# Altium project MainV2.PrjPcb
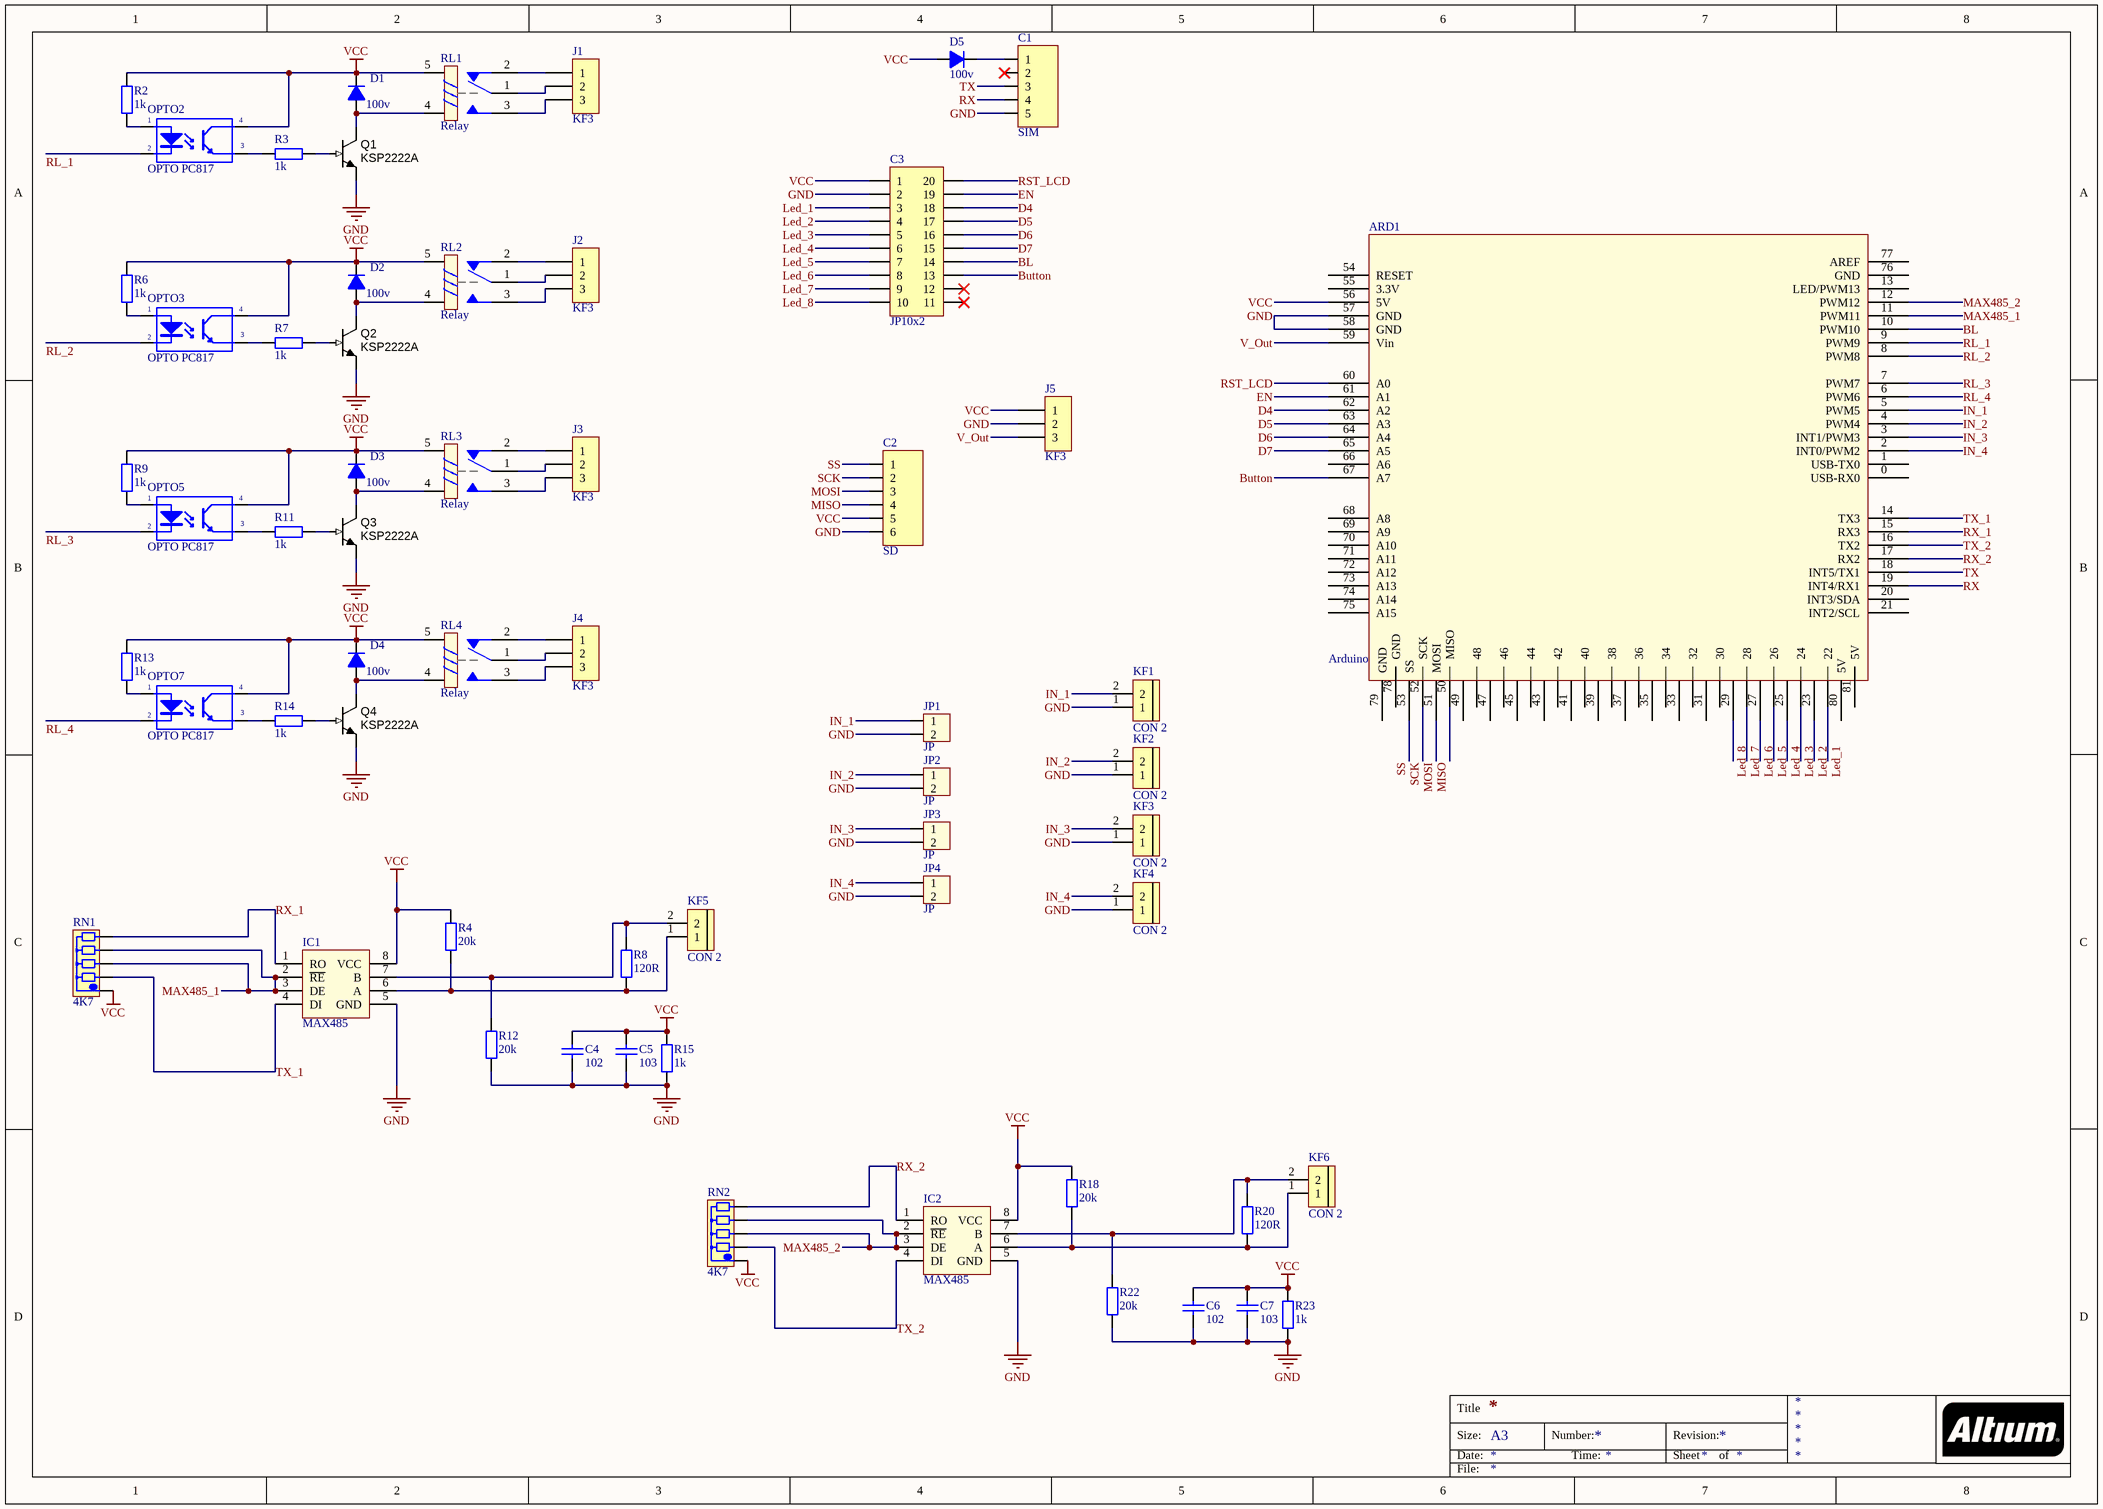
[diagram p0: Sheet4.SchDoc]
1 sheet, 60 parts. Net scope: global (net labels, ports and power ports of the same name join across sheets).
Board file: PCB4.PcbDoc

## Sheet Sheet4.SchDoc
size A3

### Parts
ARD1  Arduino  [Arduino]
C1  SIM  [JP5-C1T]
C2  SD  [JP6-C1T]
C3  JP10x2  [JP10-C2T]
C4  102  [tu gom]
C5  103  [tu gom]
C6  102  [tu gom]
C7  103  [tu gom]
D1  100v  [DIODE 1A]
D2  100v  [DIODE 1A]
D3  100v  [DIODE 1A]
D4  100v  [DIODE 1A]
D5  100v  [DIODE 1A]
IC1  MAX485  [DIP8/W0.3]
IC2  MAX485  [DIP8/W0.3]
J1  KF3  [KF3-5.08]
J2  KF3  [KF3-5.08]
J3  KF3  [KF3-5.08]
J4  KF3  [KF3-5.08]
J5  KF3  [KF3-5.08]
JP1  JP  [jam2]
JP2  JP  [jam2]
JP3  JP  [jam2]
JP4  JP  [jam2]
KF1  CON 2  [Con 2 KF301 5.08]
KF2  CON 2  [Con 2 KF301 5.08]
KF3  CON 2  [Con 2 KF301 5.08]
KF4  CON 2  [Con 2 KF301 5.08]
KF5  CON 2  [Con 2 KF301 5.08]
KF6  CON 2  [Con 2 KF301 5.08]
OPTO2  OPTO PC817  [DIP4/W0.3]
OPTO3  OPTO PC817  [DIP4/W0.3]
OPTO5  OPTO PC817  [DIP4/W0.3]
OPTO7  OPTO PC817  [DIP4/W0.3]
Q1  KSP2222A  [TO-92_Flat]
Q2  KSP2222A  [TO-92_Flat]
Q3  KSP2222A  [TO-92_Flat]
Q4  KSP2222A  [TO-92_Flat]
R2  1k  [tro vach 1/2w]
R3  1k  [tro vach 1/2w]
R4  20k  [tro vach 1/4w]
R6  1k  [tro vach 1/2w]
R7  1k  [tro vach 1/2w]
R8  120R  [tro vach 1/4w]
R9  1k  [tro vach 1/2w]
R11  1k  [tro vach 1/2w]
R12  20k  [tro vach 1/4w]
R13  1k  [tro vach 1/2w]
R14  1k  [tro vach 1/2w]
R15  1k  [tro vach 1/4w]
R18  20k  [tro vach 1/4w]
R20  120R  [tro vach 1/4w]
R22  20k  [tro vach 1/4w]
R23  1k  [tro vach 1/4w]
RL1  Relay  [Relay 5 Chan SRD]
RL2  Relay  [Relay 5 Chan SRD]
RL3  Relay  [Relay 5 Chan SRD]
RL4  Relay  [Relay 5 Chan SRD]
RN1  4K7  [RN4]
RN2  4K7  [RN4]

### Nets
GND: ARD1.57(GND) ARD1.58(GND) C1.5 C2.6 C3.2 C4.2 C5.2 C6.2 C7.2 IC1.5(GND) IC2.5(GND) J5.2 JP1.2 JP2.2 JP3.2 JP4.2 KF1.1 KF2.1 KF3.1 KF4.1 Q1.1(E) Q2.1(E) Q3.1(E) Q4.1(E) R12.1 R15.1 R22.1 R23.1
VCC: ARD1.56(5V) C2.5 C3.1 C4.1 C5.1 C6.1 C7.1 D1.2(K) D2.2(K) D3.2(K) D4.2(K) D5.1(A) IC1.8(VCC) IC2.8(VCC) J5.1 OPTO2.4(C) OPTO3.4(C) OPTO5.4(C) OPTO7.4(C) R2.2 R4.2 R6.2 R9.2 R13.2 R15.2 R18.2 R23.2 RL1.5 RL2.5 RL3.5 RL4.5 RN1.1 RN2.1
BL: ARD1.10(PWM10) C3.14
Button: ARD1.67(A7) C3.13
D4: ARD1.62(A2) C3.18
D5: ARD1.63(A3) C3.17
D6: ARD1.64(A4) C3.16
D7: ARD1.65(A5) C3.15
EN: ARD1.61(A1) C3.19
IN_1: ARD1.5(PWM5) JP1.1 KF1.2
IN_2: ARD1.4(PWM4) JP2.1 KF2.2
IN_3: ARD1.3(INT1/PWM3) JP3.1 KF3.2
IN_4: ARD1.2(INT0/PWM2) JP4.1 KF4.2
Led_1: ARD1.22 C3.3
Led_2: ARD1.23 C3.4
Led_3: ARD1.24 C3.5
Led_4: ARD1.25 C3.6
Led_5: ARD1.26 C3.7
Led_6: ARD1.27 C3.8
Led_7: ARD1.28 C3.9
Led_8: ARD1.29 C3.10
MAX485_1: ARD1.11(PWM11) IC1.2(~{RE}) IC1.3(DE) RN1.3 RN1.4
MAX485_2: ARD1.12(PWM12) IC2.2(~{RE}) IC2.3(DE) RN2.3 RN2.4
MISO: ARD1.50(MISO) C2.4
MOSI: ARD1.51(MOSI) C2.3
RL_1: ARD1.9(PWM9) OPTO2.2(K)
RL_2: ARD1.8(PWM8) OPTO3.2(K)
RL_3: ARD1.7(PWM7) OPTO5.2(K)
RL_4: ARD1.6(PWM6) OPTO7.2(K)
RST_LCD: ARD1.60(A0) C3.20
RX: ARD1.19(INT4/RX1) C1.4
RX_1: ARD1.15(RX3) IC1.1(RO) RN1.5
RX_2: ARD1.17(RX2) IC2.1(RO) RN2.5
SCK: ARD1.52(SCK) C2.2
SS: ARD1.53(SS) C2.1
TX: ARD1.18(INT5/TX1) C1.3
TX_1: ARD1.14(TX3) IC1.4(DI) RN1.2
TX_2: ARD1.16(TX2) IC2.4(DI) RN2.2
V_Out: ARD1.59(Vin) J5.3
NetC1_1: C1.1 D5.2(K)
NetD1_1: D1.1(A) Q1.3(C) RL1.4
NetD2_1: D2.1(A) Q2.3(C) RL2.4
NetD3_1: D3.1(A) Q3.3(C) RL3.4
NetD4_1: D4.1(A) Q4.3(C) RL4.4
NetIC1_6: IC1.6(A) KF5.1 R4.1 R8.1
NetIC1_7: IC1.7(B) KF5.2 R8.2 R12.2
NetIC2_6: IC2.6(A) KF6.1 R18.1 R20.1
NetIC2_7: IC2.7(B) KF6.2 R20.2 R22.2
NetJ1_1: J1.1 RL1.2
NetJ1_2: J1.2 RL1.1
NetJ1_3: J1.3 RL1.3
NetJ2_1: J2.1 RL2.2
NetJ2_2: J2.2 RL2.1
NetJ2_3: J2.3 RL2.3
NetJ3_1: J3.1 RL3.2
NetJ3_2: J3.2 RL3.1
NetJ3_3: J3.3 RL3.3
NetJ4_1: J4.1 RL4.2
NetJ4_2: J4.2 RL4.1
NetJ4_3: J4.3 RL4.3
NetOPTO2_1: OPTO2.1(A) R2.1
NetOPTO2_3: OPTO2.3(E) R3.1
NetOPTO3_1: OPTO3.1(A) R6.1
NetOPTO3_3: OPTO3.3(E) R7.1
NetOPTO5_1: OPTO5.1(A) R9.1
NetOPTO5_3: OPTO5.3(E) R11.1
NetOPTO7_1: OPTO7.1(A) R13.1
NetOPTO7_3: OPTO7.3(E) R14.1
NetQ1_2: Q1.2(B) R3.2
NetQ2_2: Q2.2(B) R7.2
NetQ3_2: Q3.2(B) R11.2
NetQ4_2: Q4.2(B) R14.2

Not connected (* = marked no-connect by the designer): ARD1 0(USB-RX0) 1(USB-TX0) 13(LED/PWM13) 20(INT3/SDA) 21(INT2/SCL) 30 31 32 33 34 35 36 37 38 39 40 41 42 43 44 45 46 47 48 49 54(RESET) 55(3.3V) 66(A6) 68(A8) 69(A9) 70(A10) 71(A11) 72(A12) 73(A13) 74(A14) 75(A15) 76(GND) 77(AREF) 78(GND) 79(GND) 80(5V) 81(5V); C1 2*; C3 11* 12*

### Notes on the sheet
- Title
- Size:
- Date:
- A3
- Number:
- Time:
- Revision:
- Sheet
- of
- File:

### Library data of the parts
C1 = JP5: WR-PHD 2.54 mm Angled Socket Header; Manufacturer: W¨¹rth Elektronik eiSos GmbH; partNo: 613005143121; ComponentLink1 Description: Manufacturer; ComponentLink2 Description: Datasheet; NoPins: 05; Created Date: 29 March 2013; ComponentLink1URL: http://www.we-online.com; ComponentLink2URL: http://katalog.we-online.de/em/datasheet/6130xx143121.pdf; Created by: Karrer Zheng
C2 = JP6: WR-PHD 2.54 mm Angled Socket Header; Manufacturer: W¨¹rth Elektronik eiSos GmbH; partNo: 613006143121; ComponentLink1 Description: Manufacturer; ComponentLink2 Description: Datasheet; NoPins: 06; Created Date: 29 March 2013; ComponentLink1URL: http://www.we-online.com; ComponentLink2URL: http://katalog.we-online.de/em/datasheet/6130xx143121.pdf; Created by: Karrer Zheng
C3 = JP10x2: WR-PHD 2.54 mm Dual Socket Header; Manufacturer: W¨¹rth Elektronik eiSos GmbH; partNo: 61302021821; ComponentLink1 Description: Manufacturer; ComponentLink2 Description: Datasheet; NoPins: 20; Created Date: 29 March 2013; ComponentLink1URL: http://www.we-online.com; ComponentLink2URL: http://katalog.we-online.de/em/datasheet/6130xx21821.pdf; Created by: Karrer Zheng
C4 C6 = Tu gom 102 50V: Cắm; Don_Vi: Con; So_Chan: 2; Ten_Linh_Kien: Tụ gốm 102 1nF 50V; Ma_Hang: MH004763; Chung_Loai: Cắm; Kieu_Chan: *
C5 C7 = Tu gom 103 50V: Cắm; So_Chan: 2; Ten_Linh_Kien: Tụ gốm 103 10nF 50V; Don_Vi: Con; Ma_Hang: MH000936; Chung_Loai: Cắm; Kieu_Chan: *
D1-D5 = Diode 1N4007: Cắm; Ten_Linh_Kien: Diode 1N4007 1A (DIP); Don_Vi: Con; Ma_Hang: MH001063; Ghi Chu: *; Kieu_Chan: *; Chung_Loai: Cắm
IC1 IC2 = MAX485: RS232 - RS485 (Same sn75176)
J1-J5 = KF3: Manufacturer: Würth Elektronik eiSos GmbH; partNo: 691103110003; ComponentLink1 Description: Manufacturer; ComponentLink2 Description: Datasheet; NoPins: 3; Created Date: 29 October 2013; ComponentLink1URL: http://www.we-online.com; ComponentLink2URL: http://katalog.we-online.de/em/datasheet/6911031100xx.pdf; Created by: Karrer Zheng
JP1-JP4 = Jam 2
KF1-KF6 = CON 2 KF301: Cắm; Ma_Hang: MH000987; Ten_Linh_Kien: CON 2 KF301-2P 5.08MM Xanh Dương; Chung_Loai: Cắm; Ghi_Chu: *; Kieu_Chan: *; Don_Vi: Con
OPTO2 OPTO3 OPTO5 OPTO7 = OPTO PC817: Single Opto; Value: PC817
Q1-Q4 = NPN_KSP2222A: Transistor SMD NPN 40V 0.6A 625mW TO-92; Manufacturer 1: Fairchild Semiconductor; Manufacturer Part Number 1: KSP2222ATF; Ratings: 40V; 0.6A; 625mW; Material: Si; SCDType: source; Package / Case: TO-92-3; Value: NPN; Mounting Type: Thru-hole; Supplier 1: Digi-Key; Supplier Part Number 1: KSP2222ATF-ND; Supplier 2: Digi-Key; Supplier Part Number 2: PN2222AD26ZTR-ND; Manufacturer 2: Fairchild Semiconductor; Manufacturer Part Number 2: PN2222ATFR; Supplier 3: Digi-Key; Supplier Part Number 3: MPS2222ARLGOSTR-ND; Manufacturer 3: ON Semiconductor; Manufacturer Part Number 3: MPS2222ARLG
R2 R3 R6 R7 R9 R11 R13 R14 = Tro Vach 1/2W 5% 1k: Cắm; Don_Vi: Con; So_Chan: 2; Ten_Linh_Kien: Trở 5% 1/2w 1K; Ma_Hang: MH007240; Chung_Loai: Cắm; Kieu_Chan: *
R4 R12 R18 R22 = Tro Vach 1/4W 5% 20k: Cắm; Don_Vi: Con; So_Chan: 2; Ten_Linh_Kien: Trở Vạch 1/4w 5% 20k; Ma_Hang: MH007297; Chung_Loai: Cắm; Kieu_Chan: *
R8 R20 = Tro Vach 1/4W 5% 120R: Cắm; Don_Vi: Con; So_Chan: 2; Ten_Linh_Kien: Trở Vạch 1/4W 5% 120R; Ma_Hang: MH007388; Chung_Loai: Cắm; Kieu_Chan: *
R15 R23 = Tro Vach 1/4W 5% 1k: Cắm; Don_Vi: Con; So_Chan: 2; Ten_Linh_Kien: Trở Vạch 1/4w 5% 1k; Ma_Hang: MH007390; Chung_Loai: Cắm; Kieu_Chan: *
RL1-RL4 = Relay 5 Chan SRD: Relay 5 Chan; Ma_Hang: MH009374; Ten: Relay 5V10A SRD-05VDC-SL-C Chính Hãng
RN1 RN2 = RN4: Resistor 4 (thanh); Value: Tro thanh 4K7